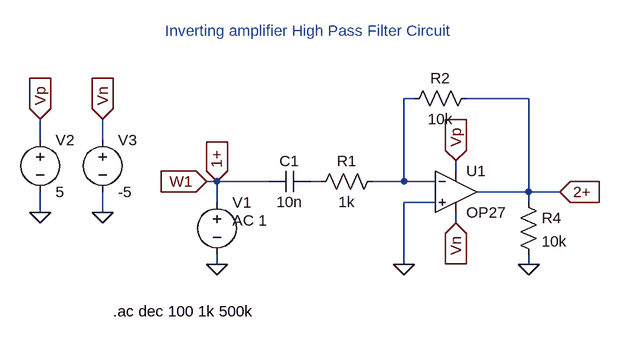
[diagram p0: schematic inv_ahpf_gain.asc]
inv_ahpf_gain.asc, the LTspice schematic file:
Version 4
SHEET 1 880 680
WIRE 384 16 368 16
WIRE 560 16 464 16
WIRE -192 80 -192 48
WIRE -96 80 -96 48
WIRE 448 128 448 112
WIRE 80 144 64 144
WIRE 160 144 80 144
WIRE 240 144 224 144
WIRE 368 144 368 16
WIRE 368 144 320 144
WIRE 416 144 368 144
WIRE 560 160 560 16
WIRE 560 160 480 160
WIRE 608 160 560 160
WIRE 80 176 80 144
WIRE 416 176 368 176
WIRE 560 176 560 160
WIRE -192 192 -192 160
WIRE -96 192 -96 160
WIRE 448 208 448 192
WIRE 80 272 80 256
WIRE 368 272 368 176
WIRE 560 272 560 256
FLAG 80 272 0
FLAG -192 192 0
FLAG -96 192 0
FLAG -192 48 Vp
IOPIN -192 48 In
FLAG -96 48 Vn
IOPIN -96 48 In
FLAG 448 112 Vp
IOPIN 448 112 In
FLAG 448 208 Vn
IOPIN 448 208 In
FLAG 560 272 0
FLAG 608 160 2+
IOPIN 608 160 In
FLAG 64 144 W1
IOPIN 64 144 In
FLAG 80 144 1+
IOPIN 80 144 In
FLAG 368 272 0
DATAFLAG 544 160 ""
DATAFLAG 544 160 ""
SYMBOL Opamps\\OP27 448 96 R0
SYMATTR InstName U1
SYMBOL cap 224 128 R90
WINDOW 0 0 32 VBottom 2
WINDOW 3 32 32 VTop 2
SYMATTR InstName C1
SYMATTR Value 10n
SYMBOL res 480 0 R90
WINDOW 0 0 56 VBottom 2
WINDOW 3 32 56 VTop 2
SYMATTR InstName R2
SYMATTR Value 10k
SYMBOL voltage 80 160 R0
WINDOW 123 24 44 Left 2
WINDOW 39 0 0 Left 0
SYMATTR Value2 AC 1
SYMATTR InstName V1
SYMATTR Value ""
SYMBOL voltage -192 64 R0
WINDOW 123 0 0 Left 0
WINDOW 39 0 0 Left 0
SYMATTR InstName V2
SYMATTR Value 5
SYMBOL voltage -96 64 R0
WINDOW 123 0 0 Left 0
WINDOW 39 0 0 Left 0
SYMATTR InstName V3
SYMATTR Value -5
SYMBOL res 544 160 R0
SYMATTR InstName R4
SYMATTR Value 10k
SYMBOL res 336 128 R90
WINDOW 0 0 56 VBottom 2
WINDOW 3 32 56 VTop 2
SYMATTR InstName R1
SYMATTR Value 1k
TEXT -80 344 Left 2 !.ac dec 100 1k 500k
TEXT 0 -88 Left 2 ;Inverting amplifier High Pass Filter Circuit

The netlist it stands for:
* inv_ahpf_gain.asc
XU1 0 N001 Vp Vn 2+ OP27  ; pins In+ In- V+ V- OUT
C1 N002 1+ 10n
R2 2+ N001 10k
V1 1+ 0 AC 1
V2 Vp 0 5
V3 Vn 0 -5
R4 2+ 0 10k
R1 N001 N002 1k
.ac dec 100 1k 500k
* Inverting amplifier High Pass Filter Circuit
.lib ADI.lib
.backanno
.end